# Altium schematic sheet STLINK.SchDoc
size B
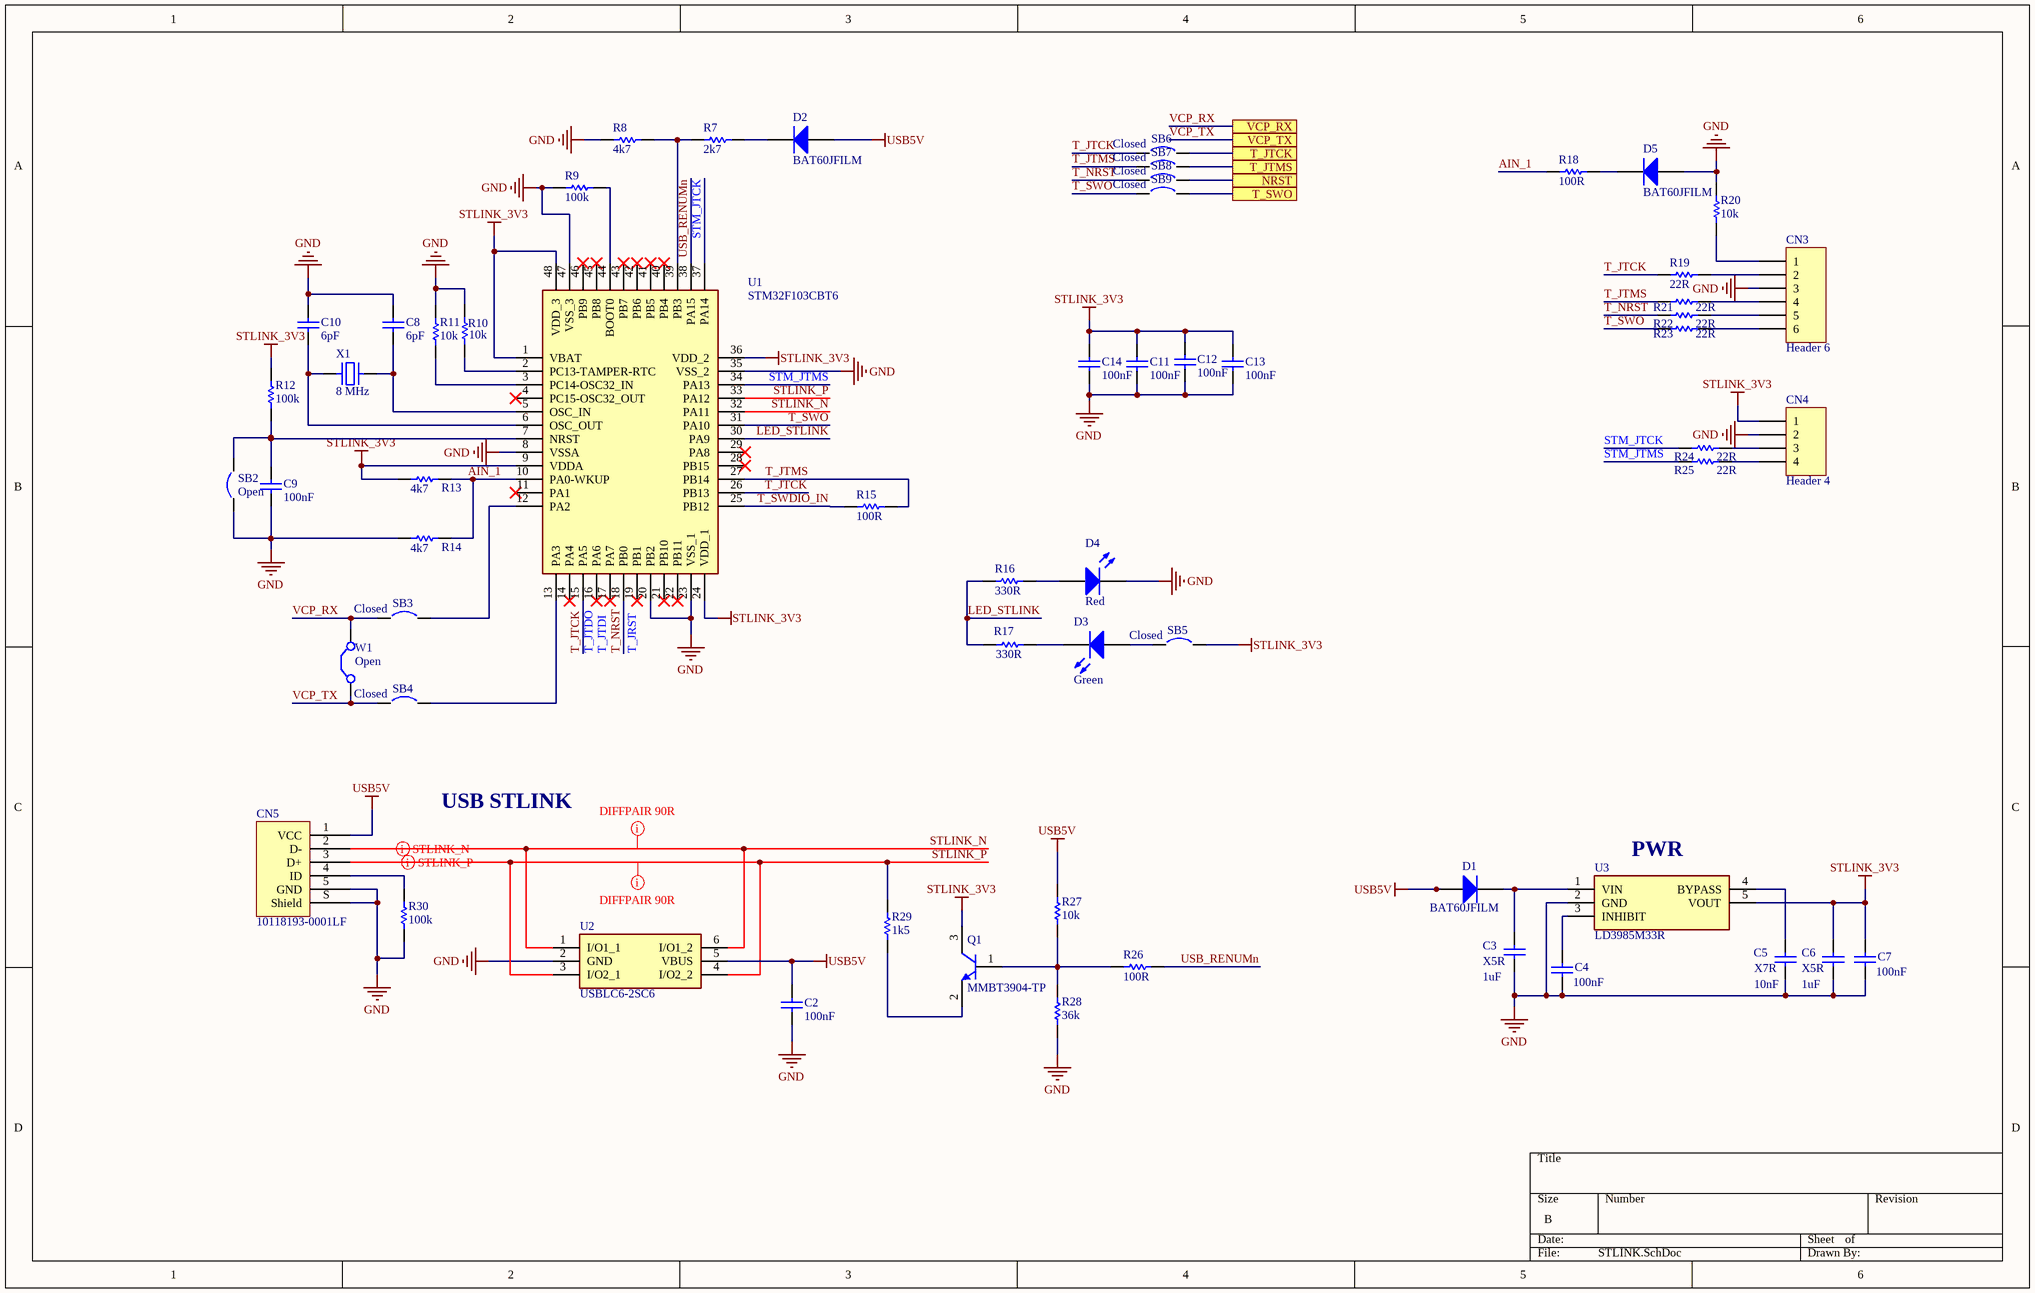
[diagram p0: STLINK.SchDoc]

## Parts
C2  value 100nF  [1608[0603]]  (hidden comment: Cap)
C3  X5R  value 1uF  [1608[0603]]
C4  value 100nF  [1608[0603]]  (hidden comment: X5R)
C5  X7R  value 10nF  [1608[0603]]
C6  X5R  value 1uF  [1608[0603]]
C7  value 100nF  [1608[0603]]  (hidden comment: X5R)
C8  value 6pF  [1608[0603]]  (hidden comment: Cap)
C9  value 100nF  [1608[0603]]  (hidden comment: Cap)
C10  value 6pF  [1608[0603]]  (hidden comment: Cap)
C11  value 100nF  [1608[0603]]  (hidden comment: Cap)
C12  value 100nF  [1608[0603]]  (hidden comment: Cap)
C13  value 100nF  [1608[0603]]  (hidden comment: Cap)
C14  value 100nF  [1608[0603]]  (hidden comment: Cap)
CN3  Header 6  [HDR1X6]
CN4  Header 4  [HDR1X4]
CN5  10118193-0001LF  [FCI USB 10118193-0001LF]
D1  BAT60JFILM  [C0805]
D2  BAT60JFILM  [C0805]
D3  Green  [1608[0603]]
D4  Red  [1608[0603]]
D5  BAT60JFILM  [C0805]
Q1  MMBT3904-TP  [MCCSEMI SOT-23-3]
R7  value 2k7  [1608[0603]]  (hidden comment: Res1)
R8  value 4k7  [1608[0603]]  (hidden comment: Res1)
R9  value 100k  [1608[0603]]  (hidden comment: Res1)
R10  value 10k  [1608[0603]]  (hidden comment: Res1)
R11  value 10k  [1608[0603]]  (hidden comment: Res1)
R12  value 100k  [1608[0603]]  (hidden comment: Res1)
R13  value 4k7  [1608[0603]]  (hidden comment: Res1)
R14  value 4k7  [1608[0603]]  (hidden comment: Res1)
R15  value 100R  [1608[0603]]  (hidden comment: Res1)
R16  value 330R  [1608[0603]]  (hidden comment: Res1)
R17  value 330R  [1608[0603]]  (hidden comment: Res1)
R18  value 100R  [1608[0603]]  (hidden comment: Res1)
R19  value 22R  [1608[0603]]  (hidden comment: Res1)
R20  value 10k  [1608[0603]]  (hidden comment: Res1)
R21  value 22R  [1608[0603]]  (hidden comment: Res1)
R22  value 22R  [1608[0603]]  (hidden comment: Res1)
R23  value 22R  [1608[0603]]  (hidden comment: Res1)
R24  value 22R  [1608[0603]]  (hidden comment: Res1)
R25  value 22R  [1608[0603]]  (hidden comment: Res1)
R26  value 100R  [1608[0603]]  (hidden comment: Res1)
R27  value 10k  [1608[0603]]  (hidden comment: Res1)
R28  value 36k  [1608[0603]]  (hidden comment: Res1)
R29  value 1k5  [1608[0603]]  (hidden comment: Res1)
R30  value 100k  [1608[0603]]  (hidden comment: Res1)
SB2  Open  [SB_0603]
SB3  Closed  [SB_0603]
SB4  Closed  [SB_0603]
SB5  Closed  [SB_0603]
SB6  Closed  [SB_0603]
SB7  Closed  [SB_0603]
SB8  Closed  [SB_0603]
SB9  Closed  [SB_0603]
U1  STM32F103CBT6  [QFP50P900X900X160-48N]
U2  USBLC6-2SC6  [SOT95P280X145-6N]
U3  LD3985M33R  [SOT95P280X145-5N]
W1  Open  [HDR1X2]
X1  8 MHz  [ECS CSM-3X]

## Ports
NRST, T_JTCK, T_JTMS, T_SWO, VCP_RX, VCP_TX

## Nets
GND: C2.1 C3.1 C4.2 C5.1 C6.1 C7.2 C8.2 C9.1 C10.2 C11.1 C12.1 C13.1 C14.1 CN3.3 CN4.2 CN5.5(GND) CN5.S(Shield) D4.2(K) D5.1(A) R8.2 R9.2 R10.2 R11.1 R14.2 R20.1 R28.1 R30.1 SB2.1 U1.8(VSSA) U1.20(PB2) U1.23(VSS_1) U1.35(VSS_2) U1.47(VSS_3) U2.2(GND) U3.2(GND)
STLINK_3V3: C6.2 C7.1 C11.2 C12.2 C13.2 C14.2 CN4.1 Q1.3(C) R12.2 R13.2 SB5.2 U1.1(VBAT) U1.9(VDDA) U1.24(VDD_1) U1.36(VDD_2) U1.48(VDD_3) U3.5(VOUT)
USB5V: C2.2 CN5.1(VCC) D1.1(A) D2.1(A) R27.2 U2.5(VBUS)
AIN_1: R13.1 R14.1 R18.1 U1.10(PA0-WKUP)
LED_STLINK: R16.2 R17.2 U1.30(PA9)
NRST: SB8.2 ; port NRST
STLINK_N: CN5.2(D-) U1.32(PA11) U2.1(I/O1_1) U2.6(I/O1_2)
STLINK_P: CN5.3(D+) R29.2 U1.33(PA12) U2.3(I/O2_1) U2.4(I/O2_2)
STM_JTCK: R24.1 U1.37(PA14)
STM_JTMS: R25.1 U1.34(PA13)
T_JRST: R22.1 SB8.1 U1.18(PB0)  [also labelled T_NRST]
T_JTCK: R19.1 SB6.1 U1.15(PA5) U1.26(PB13)
T_JTCK: SB6.2 ; port T_JTCK  [a separate net that carries the same name]
T_JTMS: R15.1 R21.1 SB7.1 U1.27(PB14)
T_JTMS: SB7.2 ; port T_JTMS  [a separate net that carries the same name]
T_SWDIO_IN: R15.2 U1.25(PB12)
T_SWO: R23.1 SB9.1 U1.31(PA10)
T_SWO: SB9.2 ; port T_SWO  [a separate net that carries the same name]
USB_RENUMn: R26.1 U1.38(PA15)
VCP_RX: SB3.1 W1.2(C2) ; port VCP_RX
VCP_TX: SB4.1 W1.1(C1) ; port VCP_TX
NetC3_2: C3.2 D1.2(K) U3.1(VIN)
NetC4_1: C4.1 U3.3(INHIBIT)
NetC5_2: C5.2 U3.4(BYPASS)
NetC8_1: C8.1 U1.5(OSC_IN) X1.2
NetC9_2: C9.2 R12.1 SB2.2 U1.7(NRST)
NetC10_1: C10.1 U1.6(OSC_OUT) X1.1
NetCN3_1: CN3.1 R20.2
NetCN3_2: CN3.2 R19.2
NetCN3_4: CN3.4 R21.2
NetCN3_5: CN3.5 R22.2
NetCN3_6: CN3.6 R23.2
NetCN4_3: CN4.3 R24.2
NetCN4_4: CN4.4 R25.2
NetCN5_4: CN5.4(ID) R30.2
NetD2_2: D2.2(K) R7.1
NetD3_1: D3.1(A) SB5.1
NetD3_2: D3.2(K) R17.1
NetD4_1: D4.1(A) R16.1
NetD5_2: D5.2(K) R18.2
NetQ1_1: Q1.1(B) R26.2 R27.1 R28.2
NetQ1_2: Q1.2(E) R29.1
NetR7_2: R7.2 R8.1 U1.39(PB3)
NetR9_1: R9.1 U1.44(BOOT0)
NetR10_1: R10.1 U1.2(PC13-TAMPER-RTC)
NetR11_2: R11.2 U1.3(PC14-OSC32_IN)
NetSB3_2: SB3.2 U1.12(PA2)
NetSB4_2: SB4.2 U1.13(PA3)

Not connected (* = marked no-connect by the designer): U1 4(PC15-OSC32_OUT)* 11(PA1)* 14(PA4)* 16(PA6)* 17(PA7)* 19(PB1)* 21(PB10)* 22(PB11)* 28(PB15)* 29(PA8)* 40(PB4)* 41(PB5)* 42(PB6)* 43(PB7)* 45(PB8)* 46(PB9)*

## Layout directives
differential pair: STLINK_N, STLINK_P
mark named DIFFPAIR 90R: STLINK_N, STLINK_P

## Notes on the sheet
- USB STLINK
- (near U3) PWR
- Labels drawn without touching a wire or pin: T_JTDI, T_JTDO

## Library data of the parts
C2-C14 = Cap: Capacitor; Published: 8-Jun-2000; LatestRevisionDate: 17-Jul-2002; LatestRevisionNote: Re-released for DXP Platform.; PackageReference: RAD-0.3; Publisher: Altium Limited; PackageDescription: Radial Cap, Thru-Hole; 2 Leads; 0.3 in Pin Spacing
CN3 = Header 6: Header, 6-Pin; LatestRevisionDate: 17-Jul-2002; LatestRevisionNote: Re-released for DXP Platform.; Publisher: Altium Limited
CN4 = Header 4: Header, 4-Pin; LatestRevisionDate: 17-Jul-2002; LatestRevisionNote: Re-released for DXP Platform.; Publisher: Altium Limited
CN5 = 10118193-0001LF: CONN RCPT USB2.0 MICRO B SMD R/A; Manufacturer: Amphenol ICC (FCI); Connector Type: USB - micro B; Current Rating (Amps): 1.8A per Contact; Gender: Receptacle; Mating Cycles: 10000; Number of Contacts: 5; Number of Ports: 1; Shielding: Shielded; Voltage - Rated: 100VAC; Part Number: 10118193-0001LF; ComponentLink1Description: Datasheet; ComponentLink1URL: https://cdn.amphenol-icc.com/media/wysiwyg/files/documentation/datasheet/inputoutput/io_usb_micro.pdf; ComponentLink2Description: DigiKey Link; ComponentLink2URL: //digikey.com/product-detail/en/amphenol-icc-fci/10118193-0001LF/609-4616-2-ND/2785388; Features: Solder Retention; LastUpdated: 12/9/2019 8:51:28 PM; Lifecycle Status: 0; Minimum Order: 1; Mounting Feature: Horizontal; Mounting Type: Surface Mount, Right Angle; Through Hole; Operating Temperature: -30°C ~ 80°C; Packaging: TapeAndReel; Part Status: Active; Price: 0.21; Series: -; Specifications: USB 2.0; Supplier 1: DigiKey; Supplier Part Number 1: 609-4616-2-ND; Termination: Solder
D1 D2 D5 = Diode: Default Diode; Published: 8-Jun-2000; LatestRevisionDate: 17-Jul-2002; LatestRevisionNote: Re-released for DXP Platform.; PackageVersion: Sep-1996; PackageReference: SMC; Publisher: Altium Limited; PackageDescription: DO-214-AB/SMC; 2 C-Bend Leads; Body 7.9 x 5.9 mm, inc. leads (LxW); Code_JEDEC: DO-214-AB
D3 D4 = LED3: Typical BLUE SiC LED; Published: 8-Jun-2000; LatestRevisionDate: 17-Dec-2003; LatestRevisionNote: PCB Footprint replaced.; DatasheetVersion: 16-Apr-2002; PackageVersion: 16-Apr-2002; PackageReference: 3.5X2.8X1.9; Publisher: Altium Limited; PackageDescription: SM LED; 2 C-Bend Leads; Body 3.5 x 2.8 x 1.9 mm, inc leads (LxWxH typ)
Q1 = MMBT3904-TP: TRANS NPN 40V 0.2A SOT23; Manufacturer: Micro Commercial Co; Current - Collector Cutoff (Max): 50nA (ICBO); Current - Collector (Ic) (Max): 200 mA; DC Current Gain (hFE) (Min) @ Ic, Vce: 100 @ 10mA, 1V; Frequency - Transition: 300MHz; Power - Max: 350 mW; Vce Saturation (Max) @ Ib, Ic: 300mV @ 5mA, 50mA; Part Number: MMBT3904-TP; ComponentLink1Description: Datasheet; ComponentLink1URL: https://www.mccsemi.com/pdf/Products/MMBT3904(SOT-23).pdf; ComponentLink2Description: DigiKey Link; ComponentLink2URL: https://www.digikey.com/en/products/detail/micro-commercial-co/MMBT3904-TP/717280; LastUpdated: 2/3/2023 9:11:21 PM; Lifecycle Status: Active; Minimum Order: 1; Mounting Type: Surface Mount; Operating Temperature: -55°C ~ 150°C (TJ); Package / Case: TO-236-3, SC-59, SOT-23-3; Packaging: TapeAndReel; PartId: 260; Part Status: Active; Price: 0.01; Series: -; Supplier 1: DigiKey; Supplier Part Number 1: MMBT3904TPMSCT-ND; Supplier Device Package: SOT-23; Transistor Type: NPN; Voltage - Collector Emitter Breakdown (Max): 40 V
R7-R30 = Res1: Resistor; Published: 8-Jun-2000; LatestRevisionDate: 17-Jul-2002; LatestRevisionNote: Re-released for DXP Platform.; PackageReference: AXIAL-0.3; Publisher: Altium Limited; PackageDescription: Axial Device, Thru-Hole; 2 Leads; 0.3 in Pin Spacing
SB2-SB9 = Circuit Breaker: Published: 24-Mar-1999; Revision: July-2002: Re-released for DXP Platform.; Publisher: Altium Limited
U1 = STM32F103CBT6: Integrated Circuit; Manufacturer_Name: STMicroelectronics; Datasheet Link: http://www.st.com/st-web-ui/static/active/en/resource/technical/document/datasheet/CD00161566.pdf; Height: 1.6mm; Manufacturer_Part_Number: STM32F103CBT6; Mouser Part Number: 511-STM32F103CBT6; Mouser Price/Stock: https://www.mouser.co.uk/ProductDetail/STMicroelectronics/STM32F103CBT6?qs=WxFF5lh7QM3goh6GV5Ogig%3D%3D; Arrow Part Number: STM32F103CBT6; Arrow Price/Stock: https://www.arrow.com/en/products/stm32f103cbt6/stmicroelectronics?region=europe
U2 = USBLC6-2SC6: Integrated Circuit; Manufacturer_Name: STMicroelectronics; Datasheet Link: http://www.st.com/st-web-ui/static/active/en/resource/technical/document/datasheet/CD00050750.pdf; Height: 1.45mm; Manufacturer_Part_Number: USBLC6-2SC6; Mouser Part Number: 511-USBLC6-2SC6; Mouser Price/Stock: https://www.mouser.co.uk/ProductDetail/STMicroelectronics/USBLC6-2SC6?qs=po45yt2pPpu%2FhNIlwQdTlg%3D%3D; Arrow Part Number: USBLC6-2SC6; Arrow Price/Stock: https://www.arrow.com/en/products/usblc6-2sc6/stmicroelectronics?region=nac
U3 = LD3985M33R: Integrated Circuit; Manufacturer_Name: STMicroelectronics; Datasheet Link: http://www.st.com/st-web-ui/static/active/en/resource/technical/document/datasheet/CD00003395.pdf; Height: 1.45mm; Manufacturer_Part_Number: LD3985M33R; Mouser Part Number: 511-LD3985M33R; Mouser Price/Stock: https://www.mouser.co.uk/ProductDetail/STMicroelectronics/LD3985M33R?qs=22WmWNTp1rrPOccVv4HZ7A%3D%3D; Arrow Part Number: LD3985M33R; Arrow Price/Stock: https://www.arrow.com/en/products/ld3985m33r/stmicroelectronics?region=nac
W1 = Jumper: Jumper Wire; Published: 24-Mar-1999; LatestRevisionDate: 17-Jul-2002; LatestRevisionNote: Re-released for DXP Platform.; PackageReference: RAD-0.2; Publisher: Altium Limited; PackageDescription: Radial Cap, Thru-Hole; 2 Leads; 0.2 in Pin Spacing
X1 = ECS-120-20-3X-EN-TR: CRYSTAL 12.0000MHZ 20PF SMD; Manufacturer: ECS Inc.; ESR (Equivalent Series Resistance): 60 Ohms; Frequency: 12 MHz; Frequency Stability: ±50ppm; Frequency Tolerance: ±30ppm; Operating Mode: Fundamental; Value: 12 MHz; Part Number: ECS-120-20-3X-EN-TR; ComponentLink1Description: Datasheet; ComponentLink1URL: http://www.ecsxtal.com/store/pdf/CSM-3X.pdf; ComponentLink2Description: DigiKey Link; ComponentLink2URL: https://www.digikey.com/en/products/detail/ecs-inc/ECS-120-20-3X-EN-TR/2676617; Height - Seated (Max): 0.091" (2.30mm); LastUpdated: 2/3/2023 8:57:34 PM; Lifecycle Status: Active; Load Capacitance: 20pF; Minimum Order: 1; Mounting Type: Surface Mount; Operating Temperature: -40°C ~ 85°C; Package / Case: HC-49/US; Packaging: TapeAndReel; PartId: 407; Part Status: Active; Price: 0.23; Series: CSM-3X; Size / Dimension: 0.276" L x 0.161" W (7.00mm x 4.10mm); Supplier 1: DigiKey; Supplier Part Number 1: XC1787CT-ND; Type: MHz Crystal